# Altium schematic sheet stm32balance.SchDoc
size A4
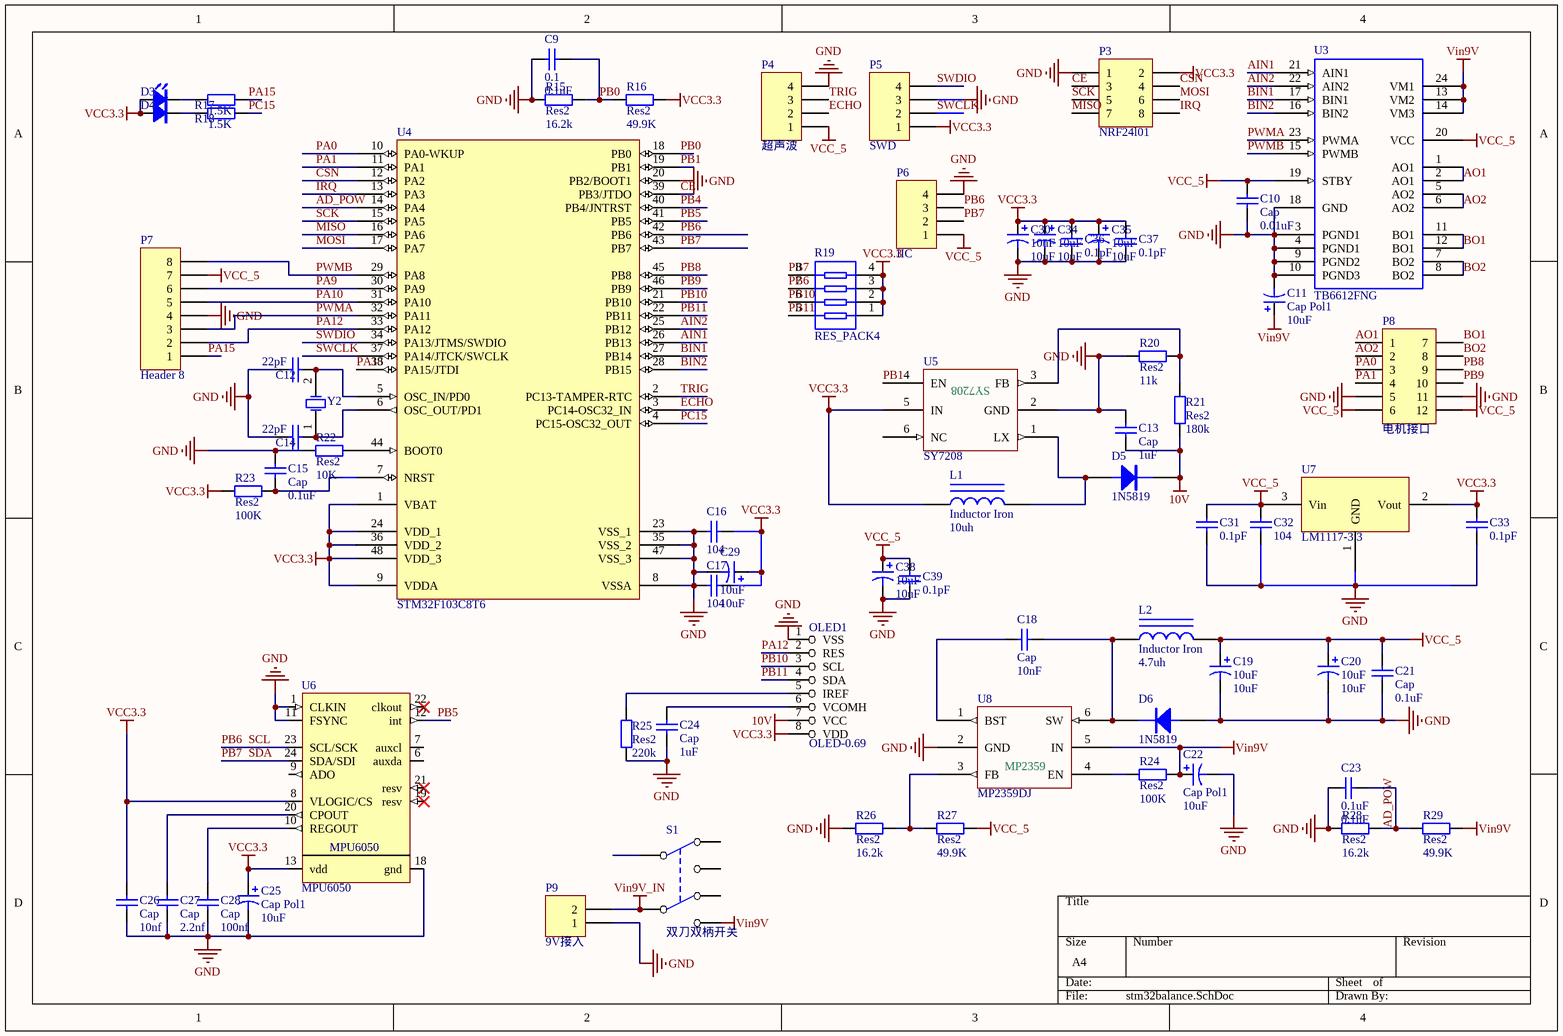
[diagram p0: stm32balance.SchDoc]

## Parts
C9  0.1  value 0.1uF  [LC-0603_C]
C10  Cap  value 0.01uF  [LC-0805_C]
C11  Cap Pol1  value 10uF  [电容HONOR_63X54]
C12  value 22pF  [LC-0603_C]  (hidden comment: CAP)
C13  Cap  value 1uF  [LC-0603_C]
C14  value 22pF  [LC-0603_C]  (hidden comment: CAP)
C15  Cap  value 0.1uF  [LC-0603_C]
C16  value 104  [LC-0603_C]  (hidden comment: Cap)
C17  value 104  [LC-0603_C]  (hidden comment: Cap)
C18  Cap  value 10nF  [LC-0603_C]
C19  10uF  [LC-1210_C]
C20  10uF  [电容HONOR_63X77]
C21  Cap  value 0.1uF  [LC-0603_C]
C22  Cap Pol1  value 10uF  [电容HONOR_63X54]
C23  0.1uF  [LC-0603_C]
C24  Cap  value 1uF  [LC-0603_C]
C25  Cap Pol1  value 10uF  [LC-1210_C]
C26  Cap  value 10nf  [LC-0603_C]
C27  Cap  value 2.2nf  [LC-0603_C]
C28  Cap  value 100nf  [LC-0603_C]
C29  10uF  [LC-1210_C]
C30  10uF  [电容HONOR_63X77]
C31  value 0.1pF  [LC-0603_C]  (hidden comment: Cap)
C32  value 104  [LC-1210_C]  (hidden comment: Cap)
C33  value 0.1pF  [LC-0603_C]  (hidden comment: Cap)
C34  10uF  [LC-1210_C]
C35  10uF  [LC-1210_C]
C36  value 0.1pF  [LC-0603_C]  (hidden comment: Cap)
C37  value 0.1pF  [LC-0603_C]  (hidden comment: Cap)
C38  10uF  [LC-1210_C]
C39  value 0.1pF  [LC-0603_C]  (hidden comment: Cap)
D3  LED  [LC-0805_LED]  (value not drawn)
D4  LED  [LC-0805_LED]  (value not drawn)
D5  1N5819  [LC-0805_LED]
D6  1N5819  [SMA]
L1  Inductor Iron  value 10uh  [LC-0805_L]
L2  Inductor Iron  value 4.7uh  [电感GDCD4532]
OLED1  OLED-0.69  [OLED-0.69]
P3  NRF24l01  [HDR2X4]
P4  超声波  [HDR1X4]
P5  SWD  [HDR1X4]
P6  IIC  [HDR1X4]
P7  Header 8  [HDR1X8]
P8  电机接口  [HDR2X6_CEN]
P9  9V接入  [HDR1X2]
R15  Res2  value 16.2k  [LC-0603_R]
R16  Res2  value 49.9K  [150PF]
R17  value 1.5K  [LC-0603_R]  (hidden comment: Res2)
R18  value 1.5K  [LC-0603_R]  (hidden comment: Res2)
R19  RES_PACK4  [RES4]
R20  Res2  value 11k  [LC-0603_R]
R21  Res2  value 180k  [LC-0603_R]
R22  Res2  value 10K  [LC-0603_R]
R23  Res2  value 100K  [LC-0603_R]
R24  Res2  value 100K  [LC-0603_R]
R25  Res2  value 220k  [LC-0603_R]
R26  Res2  value 16.2k  [LC-0603_R]
R27  Res2  value 49.9K  [LC-0603_R]
R28  Res2  value 16.2k  [LC-0603_R]
R29  Res2  value 49.9K  [LC-0603_R]
S1  双刀双柄开关  [8*8自锁开关]
U3  TB6612FNG  [SSOP24]
U4  STM32F103C8T6  [LQFP48_L]
U5  SY7208  [LC-SOT-23-6]
U6  MPU6050  [qfn24]
U7  LM1117-3.3  [SOT223]
U8  MP2359DJ  [SOT23-6]
Y2  12MHz  [49SMD]  (value not drawn)

## Nets
10V: C13.1 D5.K OLED1.7(VCC) R21.1
GND: C9.2 C10.2 C11.2 C12.1 C13.2 C14.1 C15.2 C16.2 C17.2 C19.2 C20.2 C21.1 C22.2 C23.2 C24.2 C25.2 C26.1 C27.1 C28.1 C29.2 C30.2 C31.2 C32.1 C33.2 C34.2 C35.2 C36.2 C37.2 C38.2 C39.2 D6.A OLED1.1(VSS) P3.1 P4.4 P5.3 P6.4 P7.4 P8.5 P8.11 P9.1 R15.2 R20.2 R22.1 R25.1 R26.2 R28.2 U3.3(PGND1) U3.4(PGND1) U3.9(PGND2) U3.10(PGND3) U3.18(GND) U4.8(VSSA) U4.20(PB2/BOOT1) U4.23(VSS_1) U4.35(VSS_2) U4.47(VSS_3) U5.2(GND) U6.1(CLKIN) U6.11(FSYNC) U6.18(gnd) U7.1(GND) U8.2(GND)
VCC3.3: C16.1 C17.1 C25.1 C26.2 C29.1 C30.1 C33.1 C34.1 C35.1 C36.1 C37.1 D3.1 D4.1 L1.1 OLED1.8(VDD) P3.2 P5.1 R16.1 R19.1 R19.2 R19.3 R19.4 R23.1 U4.1(VBAT) U4.9(VDDA) U4.24(VDD_1) U4.36(VDD_2) U4.48(VDD_3) U5.5(IN) U6.8(VLOGIC/CS) U6.13(vdd) U7.2(Vout)
VCC_5: C10.1 C19.1 C20.1 C21.2 C31.1 C32.2 C38.1 C39.1 L2.2 P4.1 P6.1 P7.7 P8.6 P8.12 R27.1 U3.19(STBY) U3.20(VCC) U7.3(Vin)
Vin9V: C11.1 C22.1 R24.2 R29.1 S1.6(NO2) U3.13(VM2) U3.14(VM3) U3.24(VM1) U8.5(IN)
Vin9V_IN: P9.2 S1.2(COMMON2)
AD_POW: C23.1 R28.1 R29.2 U4.14(PA4)
AIN1: U3.21(AIN1) U4.26(PB13)
AIN2: U3.22(AIN2) U4.25(PB12)
AO1: P8.1 U3.1(AO1) U3.2(AO1)
AO2: P8.2 U3.5(AO2) U3.6(AO2)
BIN1: U3.17(BIN1) U4.27(PB14)
BIN2: U3.16(BIN2) U4.28(PB15)
BO1: P8.7 U3.11(BO1) U3.12(BO1)
BO2: P8.8 U3.7(BO2) U3.8(BO2)
CE: P3.3 U4.39(PB3/JTDO)
CSN: P3.4 U4.12(PA2)
ECHO: P4.2 U4.3(PC14-OSC32_IN)
IRQ: P3.8 U4.13(PA3)
MISO: P3.7 U4.16(PA6)
MOSI: P3.6 U4.17(PA7)
PA0: P8.3 U4.10(PA0-WKUP)
PA1: P8.4 U4.11(PA1)
PA9: P7.6 U4.30(PA9)
PA10: P7.5 U4.31(PA10)
PA12: OLED1.2(RES) P7.2 U4.33(PA12)
PA15: P7.1 R17.2 U4.38(PA15/JTDI)
PB0: C9.1 R15.1 R16.2 U4.18(PB0)
PB1: U4.19(PB1) U5.4(EN)
PB4: U4.40(PB4/JNTRST)
PB5: U4.41(PB5) U6.12(int)
PB6: P6.3 R19.7 U4.42(PB6) U6.23(SCL/SCK)  [also labelled SCL]
PB7: P6.2 R19.8 U4.43(PB7) U6.24(SDA/SDI)  [also labelled SDA]
PB8: P8.9 U4.45(PB8)
PB9: P8.10 U4.46(PB9)
PB10: OLED1.3(SCL) R19.6 U4.21(PB10)
PB11: OLED1.4(SDA) R19.5 U4.22(PB11)
PC15: R18.2 U4.4(PC15-OSC32_OUT)
PWMA: P7.3 U3.23(PWMA) U4.32(PA11)
PWMB: P7.8 U3.15(PWMB) U4.29(PA8)
SCK: P3.5 U4.15(PA5)
SWCLK: P5.2 U4.37(PA14/JTCK/SWCLK)
SWDIO: P5.4 U4.34(PA13/JTMS/SWDIO)
TRIG: P4.3 U4.2(PC13-TAMPER-RTC)
NetC12_2: C12.2 U4.5(OSC_IN/PD0) Y2.2(OSC2)
NetC14_2: C14.2 U4.6(OSC_OUT/PD1) Y2.1(OSC1)
NetC15_1: C15.1 R23.2 U4.7(NRST)
NetC18_1: C18.1 U8.1(BST)
NetC18_2: C18.2 D6.K L2.1 U8.6(SW)
NetC24_1: C24.1 OLED1.6(VCOMH)
NetC27_2: C27.2 U6.20(CPOUT)
NetC28_2: C28.2 U6.10(REGOUT)
NetD3_2: D3.2 R17.1
NetD4_2: D4.2 R18.1
NetD5_A: D5.A L1.2 U5.1(LX)
NetOLED1_5: OLED1.5(IREF) R25.2
NetR20_1: R20.1 R21.2 U5.3(FB)
NetR22_2: R22.2 U4.44(BOOT0)
NetR24_1: R24.1 U8.4(EN)
NetR26_1: R26.1 R27.2 U8.3(FB)

Not connected (* = marked no-connect by the designer): S1 1(COMMON1) 3(NC1) 4(NC2) 5(NO1); U5 6(NC); U6 6(auxda) 7(auxcl) 9(ADO) 19(resv)* 21(resv)* 22(clkout)*

## Notes on the sheet
- (in symbol MP2359DJ) MP2359

## Library data of the parts
C9 C10 C13 C15-C18 C21 C23 C24 C26-C28 C31-C33 C36 C37 C39 = Cap: Capacitor; Published: 8-Jun-2000; LatestRevisionDate: 17-Jul-2002; LatestRevisionNote: Re-released for DXP Platform.; PackageReference: RAD-0.3; Publisher: Altium Limited
  C23: Value: 0.1uF
C11 C19 C20 C22 C25 C29 C30 C34 C35 C38 = Cap Pol1: Polarized Capacitor (Radial); Published: 8-Jun-2000; LatestRevisionDate: 17-Jul-2002; LatestRevisionNote: Re-released for DXP Platform.; PackageReference: RB7.6-15; Publisher: Altium Limited
  C19 C20 C29 C30 C34 C35 C38: Value: 10uF
D3 D4 = LED: pin to pad: 1>K 2>A
D5 = 1N4001
D6 = 1N4001: pin to pad: A>1 K>2
L1 L2 = Inductor Iron: Magnetic-Core Inductor; Published: 24-Mar-1999; LatestRevisionDate: 17-Jul-2002; LatestRevisionNote: Re-released for DXP Platform.; PackageReference: AXIAL-0.9; Publisher: Altium Limited
P3 = Header 4X2: Header, 4-Pin, Dual row; LatestRevisionDate: 17-Jul-2002; LatestRevisionNote: Re-released for DXP Platform.; Publisher: Altium Limited
P4-P6 = Header 4: Header, 4-Pin; LatestRevisionDate: 17-Jul-2002; LatestRevisionNote: Re-released for DXP Platform.; Publisher: Altium Limited
P7 = Header 8: Header, 8-Pin; LatestRevisionDate: 17-Jul-2002; LatestRevisionNote: Re-released for DXP Platform.; Publisher: Altium Limited
P8 = Header 6X2A: Header, 6-Pin, Dual row; LatestRevisionDate: 17-Jul-2002; LatestRevisionNote: Re-released for DXP Platform.; Publisher: Altium Limited
P9 = Header 2H: Header, 2-Pin, Right Angle; LatestRevisionDate: 17-Jul-2002; LatestRevisionNote: Re-released for DXP Platform.; Publisher: Altium Limited
R15-R18 R20-R29 = Res2: Resistor; Published: 8-Jun-2000; LatestRevisionDate: 17-Jul-2002; LatestRevisionNote: Re-released for DXP Platform.; PackageReference: AXIAL-0.4; Publisher: Altium Limited
U4 = STM32F103C8T6: STM32 ARM-based 32-bit MCU with 64 Kbytes Flash, 48-pin LQFP, Industrial Temperature; Published: 30-May-2008; DatasheetVersion: rev6, Mar-2008; PackageVersion: Mar-2008; PackageReference: LQFP48; Publisher: Altium Limited; PackageDescription: 48-Pin Low-Profile Quad Flat Pack, 7 x 7 mm Body, 0.5 mm Pitch (LQFP48); ComponentLink1Description: Manufacturer Link; ComponentLink1URL: www.st.com/stm32; ComponentLink2Description: Datasheet; ComponentLink2URL: http://www.st.com/stonline/products/literature/ds/13587.pdf
Y2 = XTAL: Crystal Oscillator; Value: 8MHZ; Published: 8-Jun-2000; LatestRevisionDate: 17-Jul-2002; LatestRevisionNote: Re-released for DXP Platform.; Publisher: Altium Limited